# EAGLE design Electricity sensor (EAGLE 5.10)
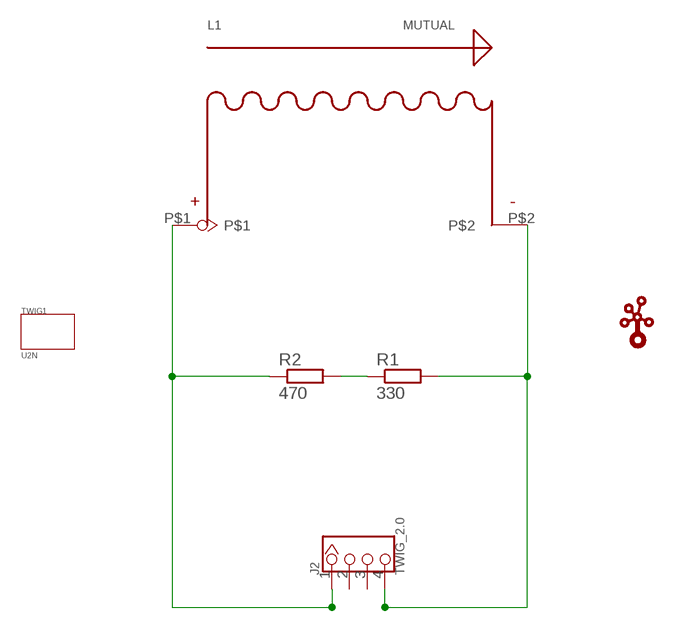
[diagram p0: schematic, sheet 1]

## Parts
J2  TWIG_2.0  [2.0_1X4]
L1  MUTUAL  [MUTUAL]
R1  330  R-EU_R0805  [R0805]
R2  470  R-EU_R0805  [R0805]
TWIG1  U2N  [U2N]
U$1  TWIGLOGOTWIGLOGO_SMALL  [TWIGLOGO_SMALL]

## Nets
GND: J2.4 L1.P$2 R1.2
N$1: R1.1 R2.2
OUT: J2.1 L1.P$1 R2.1
Unconnected: J2.2 J2.3

## Library data of the parts
J2 = CONNECTER:TWIG_2.0
L1 = AnlogDevice:MUTUAL
R1 R2 = rcl:R-EU_: RESISTOR, European symbol
TWIG1 = twig_template1:U2N
U$1 = seeedleo:TWIGLOGO

## Board
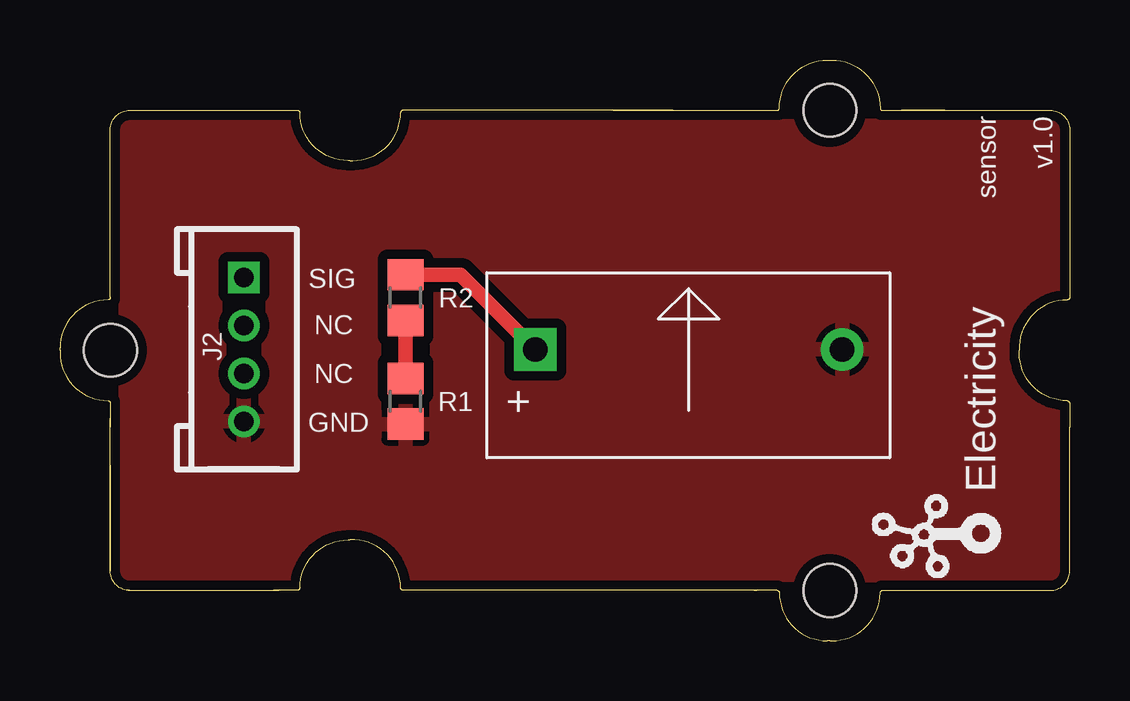
[diagram p1: board, top side]
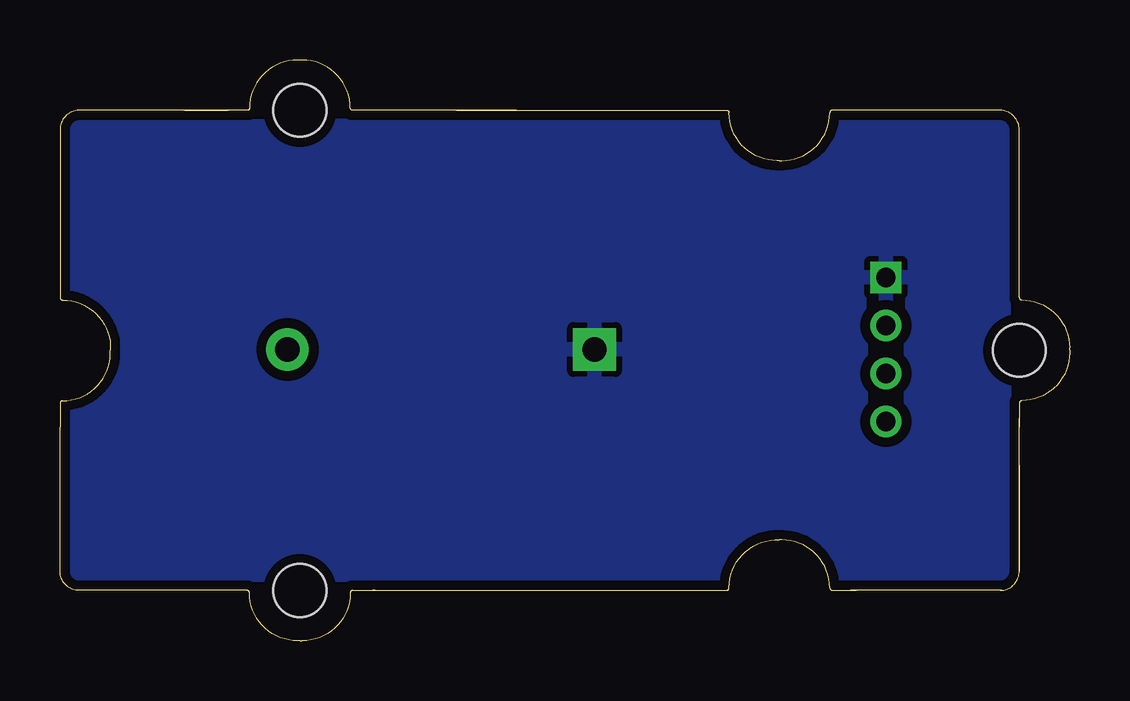
[diagram p2: board, bottom side, seen from below]

Size 42.09 x 24.2 mm. Coordinates in mm from the lower left corner, seen from the top.
Copper layers (1*16): Top 0.035mm / dielectric 1.5mm / Bottom 0.035mm
Design rules "SeeedStudio_rule_no_angle_090911": minimum track width 6mil, minimum drill 12mil, track to track 6mil, track to pad 6mil, pad to pad 6mil, via to via 6mil, smd to smd 0mil, copper to edge 10mil, drill to drill 10mil, minimum pad ring 10mil, minimum via ring 6mil, stop-mask expansion 2mil, vias tented up to drill 100mil, thermal gap 10mil

### Footprints (pad centres in the part's own frame; a part is rotated, then mirrored left to right if it is on the bottom)
2.0_1X4 = drill 0.8 pad 1.27 square: 1 -3,0 | drill 0.8 pad 1.27 round: 2 -1,0; 3 1,0; 4 3,0
MUTUAL = drill 1.016 pad 1.778 square: P$1 -6.4,0 | drill 1.016 pad 1.778 round: P$2 6.4,0
R0805 = smd 1.3 x 1.5: 1 -0.95,0; 2 0.95,0
U2N = hole 2.2: 10.453,-10.42; 10.453,9.58; -19.535,-0.415

### Placement (x,y rotation side)
J2  7.67,12.14 270 top
L1  26.21,12.14 0 top
R1  14.4,9.98 270 top
R2  14.4,14.3 270 top
TWIG1  21.64,12.52 0 top
U$1  39.36,2.23 90 top

### Tracks (layer width: path | path; a pad name or v marks a point on that pad's centre or on a via)
GND
  pour Top (isolate 0.406): -0.21,24.46 43.86,24.46 43.86,-1.45 -0.21,-1.45
N$1
  Top 0.61: R1.1 R2.2
OUT
  Top 0.61: R2.1 16.7,15.25 L1.P$1
  pour Bottom (isolate 0.406): -0.21,24.46 43.86,24.46 43.86,-1.58 -0.21,-1.58

### Text on the board
tPlace: sensor | v1.0 | SIG | NC | NC | GND | Electricity